# EAGLE design shield (EAGLE 7.5.0)
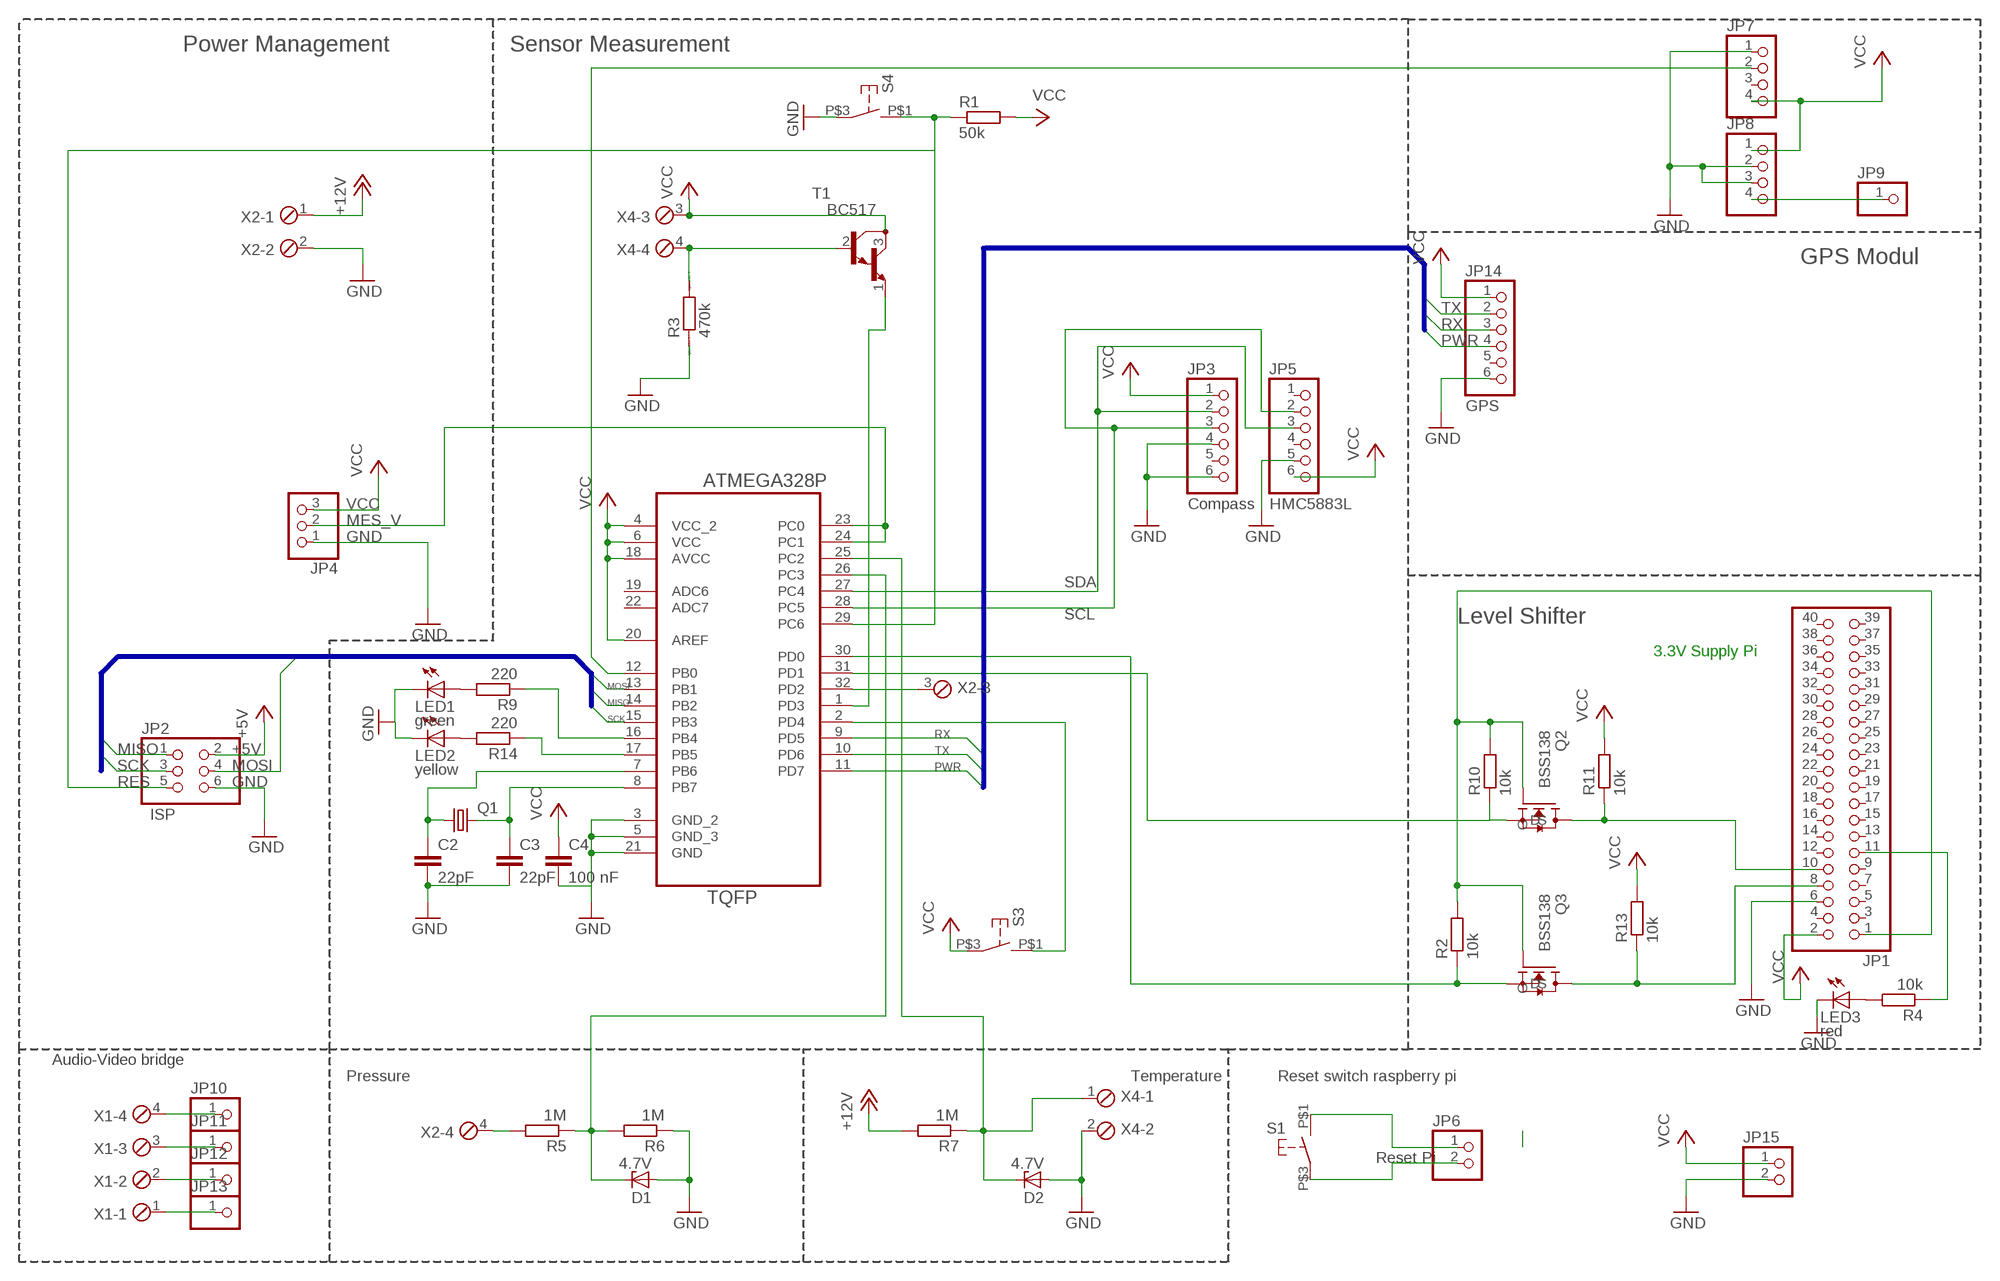
[diagram p0: schematic, sheet 1]

## Parts
C2  22pF  C-EUC1206  [C1206]
C3  22pF  C-EUC1206  [C1206]
C4  100 nF  C-EUC0603  [C0603]
D1  4.7V  ZENER-DIODESOT23  [SOT23]
D2  4.7V  ZENER-DIODESOT23  [SOT23]
IC1  ATMEGA328P-AU  [QFP80P900X900X120-32N]
JP1  PINHD-2X20  [2X20]
JP2  PINHD-2X3  [2X03]
JP3  Compass  PINHD-1X6  [1X06]
JP4  PINHD-1X3  [1X03]
JP5  HMC5883L  PINHD-1X6  [1X06]
JP6  PINHD-1X2  [1X02]
JP7  PINHD-1X4  [1X04]
JP8  PINHD-1X4  [1X04]
JP9  PINHD-1X1  [1X01]
JP10  PINHD-1X1  [1X01]
JP11  PINHD-1X1  [1X01]
JP12  PINHD-1X1  [1X01]
JP13  PINHD-1X1  [1X01]
JP14  GPS  PINHD-1X6  [1X06]
JP15  PINHD-1X2  [1X02]
LED1  green  LED3MM  [LED3MM]
LED2  yellow  LED3MM  [LED3MM]
LED3  red  LED3MM  [LED3MM]
Q1  CRYSTALHC49UP  [HC49UP]
Q2  BSS138  [BSS138]
Q3  BSS138  [BSS138]
R1  50k  R-EU_R1206  [R1206]
R2  10k  R-EU_R1206  [R1206]
R3  470k  RR1206  [R1206]
R4  10k  R-EU_R1206  [R1206]
R5  1M  R-EU_R1206  [R1206]
R6  1M  R-EU_R1206  [R1206]
R7  1M  R-EU_R1206  [R1206]
R9  220  R-EU_R1206  [R1206]
R10  10k  R-EU_R1206  [R1206]
R11  10k  R-EU_R1206  [R1206]
R13  10k  R-EU_R1206  [R1206]
R14  220  R-EU_R1206  [R1206]
S1  SCHLIESSER_TASTSCHALTER  [NAMAE-JTP-1130]
S3  SCHLIESSER_TASTSCHALTER  [NAMAE-JTP-1130]
S4  SCHLIESSER_TASTSCHALTER  [NAMAE-JTP-1130]
T1  BC517  [TO92]
X1  MPT4  [4POL254]
X2  MPT4  [4POL254]
X4  MPT4  [4POL254]

## Nets
+5V: JP2.2
+12V: R7.2 X2.1
GND: C2.2 C3.2 C4.2 D1.1(A) D2.1(A) IC1.3(GND_2) IC1.5(GND_3) IC1.21(GND) JP1.6 JP2.6 JP3.4 JP3.6 JP4.1 JP5.5 JP7.1 JP8.2 JP8.3 JP14.6 JP15.2 LED1.K(C) LED2.K(C) LED3.K(C) R3.1 R6.1 S4.P$3 X2.2 X4.2
MES_V: IC1.23(PC0) IC1.24(PC1) JP4.2
MISO: IC1.14(PB2) JP2.1
MOSI: IC1.13(PB1) JP2.4
N$1: R5.2 X2.4
N$3: C3.1 IC1.8(PB7) Q1.2
N$4: C2.1 IC1.7(PB6) Q1.1
N$5: IC1.28(PC5) JP3.3 JP5.2
N$6: R3.2 T1.2(B) X4.4
N$7: IC1.17(PB5) R14.1
N$8: JP8.4 JP9.1
N$9: IC1.32(PD2) X2.3
N$10: IC1.12(PB0) JP7.2
N$11: IC1.1(PD3) T1.1(E)
N$12: LED3.A R4.2
N$13: JP10.1 X1.4
N$14: JP11.1 X1.3
N$15: JP12.1 X1.2
N$16: JP13.1 X1.1
N$17: JP1.11 R4.1
N$19: IC1.2(PD4) S3.P$1
N$20: LED1.A R9.2
N$21: IC1.27(PC4) JP3.2 JP5.3
N$25: JP1.10 Q2.D R11.1
N$26: JP1.8 Q3.D R13.1
N$27: JP6.1 S1.P$1
N$28: JP6.2 S1.P$3
N$29: IC1.16(PB4) R9.1
N$30: LED2.A R14.2
N$46: IC1.31(PD1) Q2.S R10.1
N$47: IC1.30(PD0) Q3.S R2.1
N$51: JP1.1 Q2.G Q3.G R2.2 R10.2
PWR: IC1.11(PD7) JP14.4
RES: IC1.29(PC6) JP2.5 R1.1 S4.P$1
RESET: D1.3(C) IC1.26(PC3) R5.1 R6.2
RESET1: D2.3(C) IC1.25(PC2) R7.1 X4.1
RX: IC1.9(PD5) JP14.3
SCK: IC1.15(PB3) JP2.3
TX: IC1.10(PD6) JP14.2
VCC: C4.1 IC1.4(VCC_2) IC1.6(VCC) IC1.18(AVCC) IC1.20(AREF) JP1.2 JP3.1 JP4.3 JP5.6 JP7.4 JP8.1 JP14.1 JP15.1 R1.2 R11.2 R13.2 S3.P$3 T1.3(C) X4.3
Unconnected: IC1.19(ADC6) IC1.22(ADC7) JP1.3 JP1.4 JP1.5 JP1.7 JP1.9 JP1.12 JP1.13 JP1.14 JP1.15 JP1.16 JP1.17 JP1.18 JP1.19 JP1.20 JP1.21 JP1.22 JP1.23 JP1.24 JP1.25 JP1.26 JP1.27 JP1.28 JP1.29 JP1.30 JP1.31 JP1.32 JP1.33 JP1.34 JP1.35 JP1.36 JP1.37 JP1.38 JP1.39 JP1.40 JP3.5 JP5.1 JP5.4 JP7.3 JP14.5

## Buses
GPS:TX,RX,PWR
ISP:MOSI,MISO,SCK

## Notes on the sheet
- Power Management | Sensor Measurement
- GPS Modul
- SDA
- SCL | Level Shifter
- 3.3V Supply Pi
- ISP
- Audio-Video bridge
- Pressure | Temperature | Reset switch raspberry pi
- Reset Pi

## Library data of the parts
C2-C4 = resistor:C-EU: CAPACITOR, European symbol
D1 D2 = diode:ZENER-DIODE: Z-Diode
IC1 = Ava:ATMEGA328P-AU; DESCRIPTION: 8-bit Microcontroller with In-System Programmable Flash; MPN: ATMEGA328P-AU; OC_FARNELL: 1715486; OC_NEWARK: 14R4631; PACKAGE: TQFP-32; SUPPLIER: Atmel
JP1 = pinhead:PINHD-2X20: PIN HEADER
JP2 = pinhead:PINHD-2X3: PIN HEADER
JP3 JP5 JP14 = pinhead:PINHD-1X6: PIN HEADER
JP4 = pinhead:PINHD-1X3: PIN HEADER
JP6 JP15 = pinhead:PINHD-1X2: PIN HEADER
JP7 JP8 = pinhead:PINHD-1X4: PIN HEADER
JP9-JP13 = pinhead:PINHD-1X1: PIN HEADER
LED1-LED3 = led:LED: LED OSRAM: - CHIPLED LG R971, LG N971, LY N971, LG Q971, LY Q971, LO R971, LY R971 LH N974, LH R974 LS Q976, LO Q976, LY Q976 LO Q996 - Hyper CHIPLED LW Q18S LB Q993, LB Q99A, LB R99A - SideLED LS A670, LO A670, LY A670, LG A670, LP A670 LB A673, LV A673, LT A673, LW A673 LH A674 LY A675 LS A676, LA A676, LO A676, LY A676, LW A676 LS A679, LY A679, LG A679 - Hyper Micro SIDELED® LS Y876, LA Y876, LO Y876, LY Y876 LT Y87S - SmartLED LW L88C, LW L88S LB L89C, LB L89S, LG L890 LS L89K, LO L89K, LY L89K LS L896, LA L896, LO L896, LY L896 - TOPLED LS T670, LO T670, LY T670, LG T670, LP T670 LSG T670, LSP T670, LSY T670, LOP T670, LYG T670 LG T671, LOG T671, LSG T671 LB T673, LV T673, LT T673, LW T673 LH T674 LS T676, LA T676, LO T676, LY T676, LB T676, LH T676, LSB T676, LW T676 LB T67C, LV T67C, LT T67C, LS T67K, LO T67K, LY T67K, LW E67C LS E67B, LA E67B, LO E67B, LY E67B, LB E67C, LV E67C, LT E67C LW T67C LS T679, LY T679, LG T679 LS T770, LO T770, LY T770, LG T770, LP T770 LB T773, LV T773, LT T773, LW T773 LH T774 LS E675, LA E675, LY E675, LS T675 LS T776, LA T776, LO T776, LY T776, LB T776 LHGB T686 LT T68C, LB T68C - Hyper Mini TOPLED® LB M676 - Mini TOPLED Santana® LG M470 LS M47K, LO M47K, LY M47K Source: http://www.osram.convergy.de LUXEON: - LUMILED® LXK2-PW12-R00, LXK2-PW12-S00, LXK2-PW14-U00, LXK2-PW14-V00 LXK2-PM12-R00, LXK2-PM12-S00, LXK2-PM14-U00 LXK2-PE12-Q00, LXK2-PE12-R00, LXK2-PE12-S00, LXK2-PE14-T00, LXK2-PE14-U00 LXK2-PB12-K00, LXK2-PB12-L00, LXK2-PB12-M00, LXK2-PB14-N00, LXK2-PB14-P00, LXK2-PB14-Q00 LXK2-PR12-L00, LXK2-PR12-M00, LXK2-PR14-Q00, LXK2-PR14-R00 LXK2-PD12-Q00, LXK2-PD12-R00, LXK2-PD12-S00 LXK2-PH12-R00, LXK2-PH12-S00 LXK2-PL12-P00, LXK2-PL12-Q00, LXK2-PL12-R00 Source: www.luxeon.com KINGBRIGHT: KA-3528ASYC Source: www.kingbright.com
Q1 = crystal:CRYSTAL: CRYSTAL; OC_FARNELL: unknown; OC_NEWARK: unknown
Q2 Q3 = Ava:BSS138: BSS138 N-Channel Logic Level Enhancement Mode Field Effect Transistor
R1 R2 R4 R9-R11 R13 R14 = resistor:R-EU_: RESISTOR, European symbol
R3 = eagle-ltspice:R: RESISTOR, European symbol; SPICEMODEL: NONE; SPICEPREFIX: R
R5-R7 = rcl:R-EU_: RESISTOR, European symbol
S1 S3 S4 = 0liver:SCHLIESSER_TASTSCHALTER: Tastschalter, Schließer
T1 = transistor:BC517: NPN BIPOLAR DARLINGTON TRANSISTOR
X1 X2 X4 = con-phoenix-254:MPT4: PHOENIX CONNECTOR; OC_FARNELL: unknown; OC_NEWARK: unknown

## Board
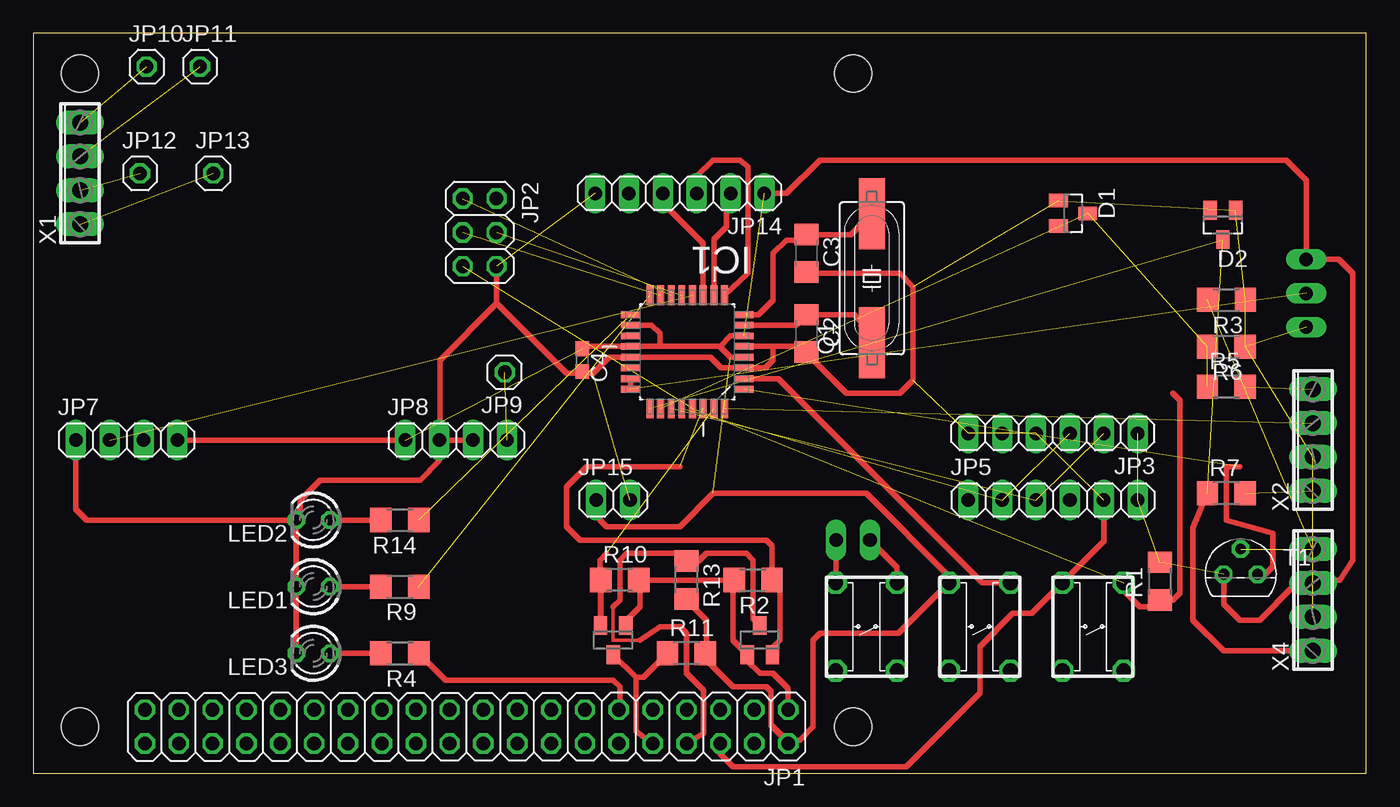
[diagram p1: board, top side]
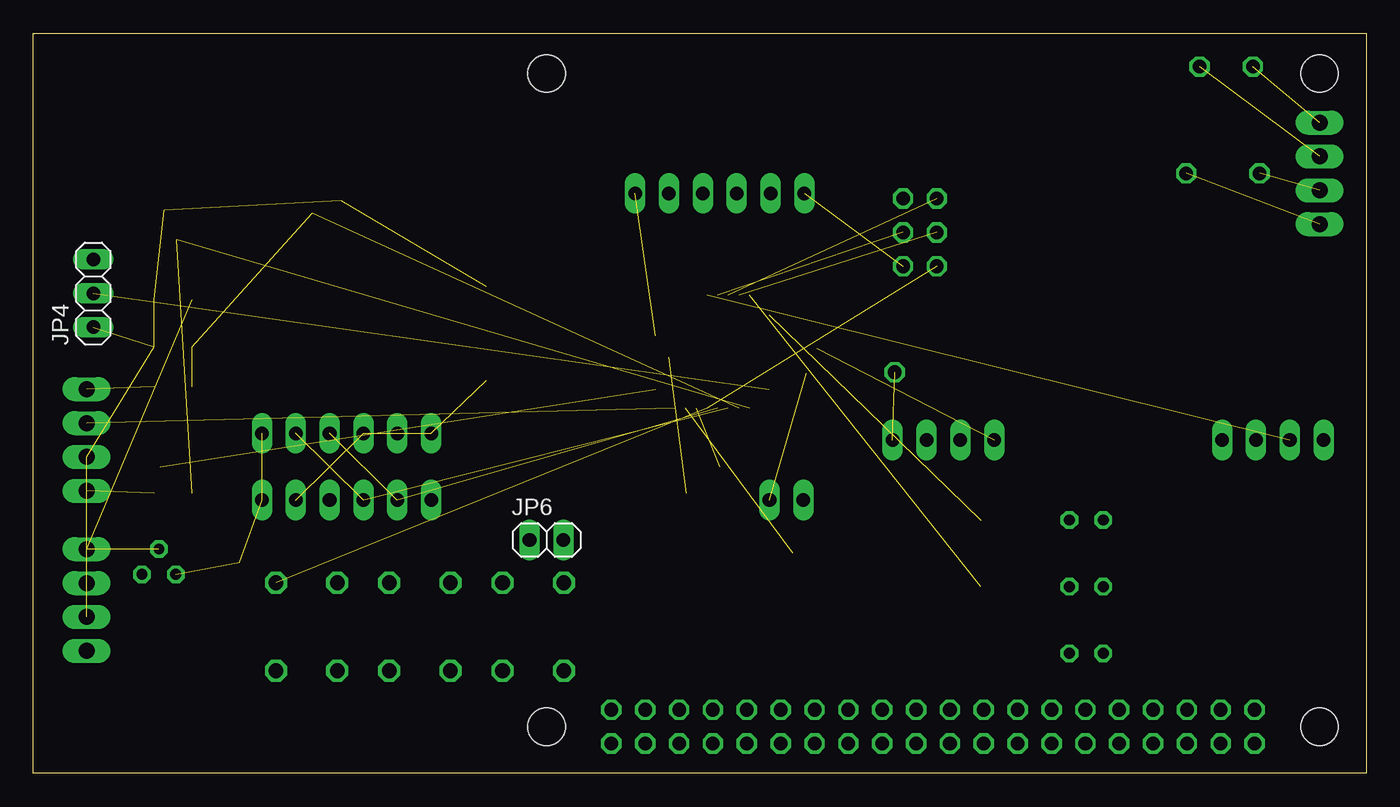
[diagram p2: board, bottom side, seen from below]

Size 100 x 55.5 mm. Coordinates in mm from the lower left corner, seen from the top.
Outline: 0,0 100,0 100,55.5 0,55.5 0,0
Copper layers (1*16): Top 0.035mm / dielectric 1.5mm / Bottom 0.035mm
Design rules "default": minimum track width 10mil, minimum drill 24mil, track to track 8mil, track to pad 8mil, pad to pad 8mil, via to via 8mil, smd to smd 8mil, copper to edge 40mil, drill to drill 8mil, minimum pad ring 10mil, minimum via ring 8mil, stop-mask expansion 4mil, vias tented up to drill 0mil, thermal gap 10mil
Holes 2.8 mm at 3.5,3.5 61.5,3.5 61.5,52.5 3.5,52.5

### Footprints (pad centres in the part's own frame; a part is rotated, then mirrored left to right if it is on the bottom)
C1206 = smd 1.6 x 1.8: 1 -1.4,0; 2 1.4,0
C0603 = smd 1.1 x 1: 1 -0.85,0; 2 0.85,0
SOT23 = smd 1 x 1.4: 1 -0.95,-1.1; 2 0.95,-1.1; 3 0,1.1
QFP80P900X900X120-32N = smd 1.473 x 0.508: 1 -4.242,2.794; 2 -4.242,2.007; 3 -4.242,1.194; 4 -4.242,0.406; 5 -4.242,-0.406; 6 -4.242,-1.194; 7 -4.242,-2.007; 8 -4.242,-2.794; 17 4.242,-2.794; 18 4.242,-2.007; 19 4.242,-1.194; 20 4.242,-0.406; 21 4.242,0.406; 22 4.242,1.194; 23 4.242,2.007; 24 4.242,2.794 | smd 0.508 x 1.473: 9 -2.794,-4.242; 10 -2.007,-4.242; 11 -1.194,-4.242; 12 -0.406,-4.242; 13 0.406,-4.242; 14 1.194,-4.242; 15 2.007,-4.242; 16 2.794,-4.242; 25 2.794,4.242; 26 2.007,4.242; 27 1.194,4.242; 28 0.406,4.242; 29 -0.406,4.242; 30 -1.194,4.242; 31 -2.007,4.242; 32 -2.794,4.242
2X20 = drill 1.016 octagon: 1 -24.13,-1.27; 2 -24.13,1.27; 3 -21.59,-1.27; 4 -21.59,1.27; 5 -19.05,-1.27; 6 -19.05,1.27; 7 -16.51,-1.27; 8 -16.51,1.27; 9 -13.97,-1.27; 10 -13.97,1.27; 11 -11.43,-1.27; 12 -11.43,1.27; 13 -8.89,-1.27; 14 -8.89,1.27; 15 -6.35,-1.27; 16 -6.35,1.27; 17 -3.81,-1.27; 18 -3.81,1.27; 19 -1.27,-1.27; 20 -1.27,1.27; 21 1.27,-1.27; 22 1.27,1.27; 23 3.81,-1.27; 24 3.81,1.27; 25 6.35,-1.27; 26 6.35,1.27; 27 8.89,-1.27; 28 8.89,1.27; 29 11.43,-1.27; 30 11.43,1.27; 31 13.97,-1.27; 32 13.97,1.27; 33 16.51,-1.27; 34 16.51,1.27; 35 19.05,-1.27; 36 19.05,1.27; 37 21.59,-1.27; 38 21.59,1.27; 39 24.13,-1.27; 40 24.13,1.27
2X03 = drill 1.016 octagon: 1 -2.54,-1.27; 2 -2.54,1.27; 3 0,-1.27; 4 0,1.27; 5 2.54,-1.27; 6 2.54,1.27
1X06 = drill 1.016 long: 1 -6.35,0; 2 -3.81,0; 3 -1.27,0; 4 1.27,0; 5 3.81,0; 6 6.35,0
1X03 = drill 1.016 long: 1 -2.54,0; 2 0,0; 3 2.54,0
1X02 = drill 1.016 long: 1 -1.27,0; 2 1.27,0
1X04 = drill 1.016 long: 1 -3.81,0; 2 -1.27,0; 3 1.27,0; 4 3.81,0
1X01 = drill 1.016 octagon: 1 0,0
LED3MM = drill 0.813 octagon: A -1.27,0; K 1.27,0
HC49UP = smd 5.334 x 1.93: 1 -4.826,0; 2 4.826,0
BSS138 = smd 1 x 1.4: D 0,1.1; G -0.95,-1.1; S 0.95,-1.1
R1206 = smd 1.6 x 1.803: 1 -1.422,0; 2 1.422,0
NAMAE-JTP-1130 = drill 1.1 octagon: P$1 3.3,-2.3; P$2 -3.3,-2.3; P$3 3.3,2.3; P$4 -3.3,2.3
TO92 = drill 0.813 octagon: 1 1.27,0; 2 0,1.905; 3 -1.27,0
4POL254 = drill 1.2 long: 1 -3.81,0; 2 -1.27,0; 3 1.27,0; 4 3.81,0

### Placement (x,y rotation side)
C2  58,33 270 top
C3  58,39 270 top
C4  41.19,30.99 270 top
D1  78,42 270 top
D2  89.24,41.13 180 top
IC1  49.06,31.61 180 top
JP1  32.5,3.5 180 top
JP2  33.48,40.57 270 top
JP3  76.5,25.5 180 top
JP4  95.5,36 90 bottom
JP5  76.5,20.5 0 top
JP6  61.5,17.5 0 bottom
JP7  7,25 0 top
JP8  31.72,25 0 top
JP9  35.37,30.08 180 top
JP10  8.5,53 0 top
JP11  12.5,53 0 top
JP12  8,45 0 top
JP13  13.5,45 0 top
JP14  48.5,43.5 180 top
JP15  43.5,20.5 0 top
LED1  21,14 180 top
LED2  21,19 180 top
LED3  21,9 180 top
Q1  62.91,37.13 90 top
Q2  43.5,10 180 top
Q3  54.5,10 0 top
R1  84.51,14.41 90 top
R2  54,14.5 180 top
R3  89.51,35.51 180 top
R4  27.5,9 180 top
R5  89.5,29 0 top
R6  89.5,32 180 top
R7  89.5,21 0 top
R9  27.5,14 180 top
R10  44,14.5 0 top
R11  49,9 0 top
R13  49,14.5 270 top
R14  27.5,19 180 top
S1  62.5,11 90 top
S3  71,11 90 top
S4  79.5,11 90 top
T1  90.58,14.92 0 top
X1  3.5,45 90 top
X2  96,25 90 top
X4  96,13 90 top

### Tracks (layer width: path | path; a pad name or v marks a point on that pad's centre or on a via)
+12V  (1 unrouted)
GND  (12 unrouted)
  Top 0.406: JP1.6 51.55,1.45 52.5,0.5 65.5,0.5 71,6 71,9.5 73.5,12 74.9,12 S4.P$3 80.31,17.41 JP5.5 | IC1.5 55.5,32.02 | 55.5,32.02 57.42,32.02 C2.2 58,31.5 61,28.5 65,28.5 66,29.5 66,36.5 65,37.5 58.1,37.5 C3.2 | 55.5,32.02 55.5,31 54.92,30.42 IC1.3 51.58,30.42 50.8,31.2 IC1.21 43.2,31.2 42,30 41.33,30 C4.2 41.05,30 40,30 34.75,35.25 | LED2.K LED1.K LED3.K | JP2.6 34.75,35.25 | 34.75,35.25 30.5,31 30.5,25.05 JP8.2 | JP8.2 JP8.3 | JP8.2 30.45,23.45 29,22 21.5,22 20,20.5 20,19.27 LED2.K | JP7.1 3.19,19.81 4,19 LED2.K
MES_V  (1 unrouted)
  Top 0.406: IC1.23 IC1.24
MISO  (1 unrouted)
MOSI  (1 unrouted)
N$1  (1 unrouted)
N$3
  Top 0.406: Q1.2 61.35,40.4 C3.1 57.6,40 56.5,40 55.5,39 55.5,35.5 54.4,34.4 IC1.8
N$4
  Top 0.406: 62.1,33.62 Q1.1 63,32.39 63,33 61.6,34.4 C2.1 57.22,33.62 IC1.7
N$5  (2 unrouted)
N$6  (2 unrouted)
N$7  (1 unrouted)
N$8  (1 unrouted)
N$9  (1 unrouted)
N$10  (1 unrouted)
N$11  (1 unrouted)
  Top 0.406: T1.1 92.42,14.92 93,15.5 93,18 89.5,19 89.5,23 90.5,23
N$12
  Top 0.406: LED3.A R4.2
N$13  (1 unrouted)
N$14  (1 unrouted)
N$15  (1 unrouted)
N$16  (1 unrouted)
N$17
  Top 0.406: R4.1 30.92,7 43.5,7 44,6.5 44,4.84 JP1.11
N$19
  Top 0.406: S3.P$1 71.2,14.3 55.9,29.6 IC1.2
N$20
  Top 0.406: LED1.A R9.2
N$21  (2 unrouted)
N$25
  Top 0.406: 45.2,7.2 45.2,3.15 JP1.10 | 45.2,7.2 Q2.D | 45.2,7.2 45.78,7.2 R11.1
N$26
  Top 0.254: 45.5,10 43.5,10 43.5,12.5
  Top 0.406: Q3.D 54,11.6 54,16 53.5,16.5 50.5,16.5 49.92,15.92 R13.1 48.42,16.5 44.5,16.5 44,16 44,13 43.5,12.5 | JP1.8 50.28,3 50.28,6.22 49,7.5 49,10.5 48.5,11 47,11 45.5,10
N$27
  Top 0.406: S1.P$1 64.8,15.47 JP6.1
N$28
  Top 0.406: JP6.2 60.23,14.33 S1.P$3
N$29  (1 unrouted)
N$30
  Top 0.406: LED2.A R14.2
N$46  (1 unrouted)
  Top 0.406: R10.1 42.58,11.13 Q2.S 42.55,14.45 42.5,14.5 42.5,16 43,16.5
N$47  (1 unrouted)
  Top 0.406: Q3.S 55.45,9.45 56,10 56,13.92 R2.1 55.42,17.08 55,17.5 41,17.5 40,18.5 40,21.5 41.5,23 48.5,23
N$51
  Top 0.406: Q2.G 44.45,11.45 45.5,12.5 45.5,14.42 R10.2 R2.2 52.5,14.42 52.5,10 53.55,8.95 Q3.G 53.5,8.85 53.5,8.5 54.5,7.5 55.5,7.5 56.63,6.37 JP1.1
PWR
  Top 0.406: JP14.4 47.23,42.77 50.25,39.75 IC1.11
RES  (2 unrouted)
  Top 0.406: 85.5,28.5 86,28 86,13.5 85.49,12.99 R1.1 84.02,12.5 83,12.5 81.8,13.7 S4.P$1
RESET  (3 unrouted)
RESET1  (2 unrouted)
  Top 0.406: X4.1 89.31,9.19 87,11.5 87,18.42 R7.1
RX
  Top 0.406: JP14.3 49.77,44.77 51,46 53,46 53.6,45.5 53.6,37.5 IC1.9
SCK  (1 unrouted)
TX
  Top 0.406: IC1.10 51.07,40.07 52,41 52,43.19 JP14.2
VCC  (6 unrouted)
  Top 0.406: 50.5,9.58 50.5,11.5 49,13 R13.2 | 50.5,9.58 R11.2 50.5,9.42 50.5,8.5 52.5,6.5 55,6.5 55.35,6.15 55.35,3.65 | 50.5,9.58 50.5,9.5 | JP1.2 56.63,2.32 55.35,3.6 55.35,3.65 | 55.35,3.65 56.5,2.5 57.5,2.5 58.5,3.5 58.5,10 59,10.5 64.9,10.5 S3.P$3 68.7,14.8 62.5,21 51,21 48.5,18.5 43,18.5 42.5,19 42.5,20.23 JP15.1 | T1.3 89.31,12.69 90.5,11.5 92,11.5 94.5,14 96.73,14 X4.3 96.73,14.5 98,14.5 99,16 99,37.5 97.96,38.54 JP4.3 95.5,44.5 94,46 59,46 56.5,43.5 JP14.1 | C4.1 41.37,32.02 IC1.20 47,32.02 | IC1.6 52.3,32.8 51.5,32 | IC1.4 52.3,31.2 51.5,32 | 47,32.02 51.48,32.02 51.5,32 | IC1.18 46.38,33.62 47,33 47,32.02 | JP7.4 JP8.1

### Text on the board
Rohr: h=5 | h=10 | h=15 | h=20